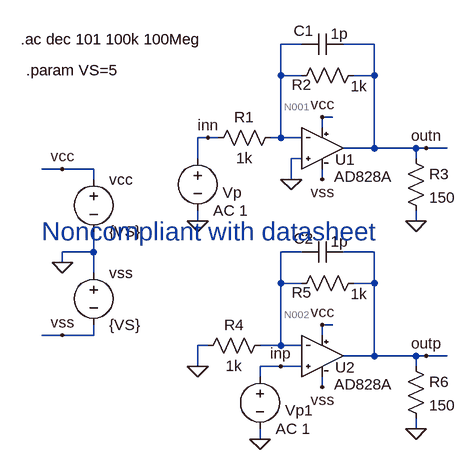
[diagram p0: schematic 03-ad828a_active_probe_ac.asc]
03-ad828a_active_probe_ac.asc, the LTspice schematic file:
Version 4
SHEET 1 880 680
WIRE 256 -240 224 -240
WIRE 368 -240 320 -240
WIRE 224 -192 224 -240
WIRE 256 -192 224 -192
WIRE 368 -192 368 -240
WIRE 368 -192 336 -192
WIRE 304 -128 288 -128
WIRE 288 -112 288 -128
WIRE 112 -96 96 -96
WIRE 128 -96 112 -96
WIRE 224 -96 224 -192
WIRE 224 -96 208 -96
WIRE 256 -96 224 -96
WIRE 368 -80 368 -192
WIRE 368 -80 320 -80
WIRE 432 -80 368 -80
WIRE 448 -80 432 -80
WIRE 480 -80 448 -80
WIRE 96 -64 96 -96
WIRE 256 -64 240 -64
WIRE 432 -64 432 -80
WIRE -112 -48 -144 -48
WIRE -64 -48 -112 -48
WIRE -64 -32 -64 -48
WIRE 240 -32 240 -64
WIRE 288 -32 288 -48
WIRE 96 32 96 16
WIRE 432 32 432 16
WIRE -64 80 -64 48
WIRE -64 80 -112 80
WIRE 256 80 224 80
WIRE 368 80 320 80
WIRE -112 96 -112 80
WIRE -64 112 -64 80
WIRE 224 128 224 80
WIRE 256 128 224 128
WIRE 368 128 368 80
WIRE 368 128 336 128
WIRE 304 192 288 192
WIRE -112 208 -144 208
WIRE -64 208 -64 192
WIRE -64 208 -112 208
WIRE 288 208 288 192
WIRE 112 224 96 224
WIRE 224 224 224 128
WIRE 224 224 192 224
WIRE 256 224 224 224
WIRE 368 240 368 128
WIRE 368 240 320 240
WIRE 432 240 368 240
WIRE 448 240 432 240
WIRE 480 240 448 240
WIRE 96 256 96 224
WIRE 224 256 192 256
WIRE 256 256 224 256
WIRE 432 256 432 240
WIRE 192 272 192 256
WIRE 288 288 288 272
WIRE 432 352 432 336
WIRE 192 368 192 352
FLAG -112 96 0
FLAG -112 208 vss
FLAG -112 -48 vcc
FLAG 288 -128 vcc
FLAG 288 -32 vss
FLAG 96 32 0
FLAG 240 -32 0
FLAG 432 32 0
FLAG 448 -80 outn
FLAG 112 -96 inn
FLAG 288 192 vcc
FLAG 288 288 vss
FLAG 192 368 0
FLAG 96 256 0
FLAG 432 352 0
FLAG 448 240 outp
FLAG 224 256 inp
SYMBOL AD828A 288 -80 R0
WINDOW 0 35 33 Bottom 2
WINDOW 3 63 28 Top 2
SYMATTR InstName U1
SYMBOL voltage -64 96 R0
SYMATTR InstName vss
SYMATTR Value {VS}
SYMBOL voltage -64 -48 R0
WINDOW 123 0 0 Left 0
WINDOW 39 0 0 Left 0
SYMATTR InstName vcc
SYMATTR Value {VS}
SYMBOL voltage 96 -80 R0
WINDOW 0 39 68 Left 2
SYMATTR InstName Vp
SYMATTR Value AC 1
SYMBOL res 224 -112 R90
WINDOW 0 0 56 VBottom 2
WINDOW 3 32 56 VTop 2
SYMATTR InstName R1
SYMATTR Value 1k
SYMBOL res 352 -208 R90
WINDOW 0 46 96 VBottom 2
WINDOW 3 17 8 VTop 2
SYMATTR InstName R2
SYMATTR Value 1k
SYMBOL cap 320 -256 R90
WINDOW 0 11 61 VBottom 2
WINDOW 3 -16 6 VTop 2
SYMATTR InstName C1
SYMATTR Value 1p
SYMBOL res 416 -80 R0
SYMATTR InstName R3
SYMATTR Value 150
SYMBOL AD828A 288 240 R0
WINDOW 0 35 33 Bottom 2
WINDOW 3 63 28 Top 2
SYMATTR InstName U2
SYMBOL voltage 192 256 R0
WINDOW 0 39 68 Left 2
SYMATTR InstName Vp1
SYMATTR Value AC 1
SYMBOL res 208 208 R90
WINDOW 0 0 56 VBottom 2
WINDOW 3 32 56 VTop 2
SYMATTR InstName R4
SYMATTR Value 1k
SYMBOL res 352 112 R90
WINDOW 0 46 96 VBottom 2
WINDOW 3 17 8 VTop 2
SYMATTR InstName R5
SYMATTR Value 1k
SYMBOL cap 320 64 R90
WINDOW 0 11 61 VBottom 2
WINDOW 3 -16 6 VTop 2
SYMATTR InstName C2
SYMATTR Value 1p
SYMBOL res 416 240 R0
SYMATTR InstName R6
SYMATTR Value 150
TEXT -176 -248 Left 2 !.ac dec 101 100k 100Meg
TEXT -168 -200 Left 2 !.param VS=5
TEXT -144 48 Left 4 ;Noncompliant with datasheet

The netlist it stands for:
* 03-ad828a_active_probe_ac.asc
XU1 0 N001 vcc vss outn AD828A  ; pins 2 1 99 50 46
vss 0 vss {VS}
vcc vcc 0 {VS}
Vp inn 0 AC 1
R1 N001 inn 1k
R2 outn N001 1k
C1 outn N001 1p
R3 outn 0 150
XU2 inp N002 vcc vss outp AD828A  ; pins 2 1 99 50 46
Vp1 inp 0 AC 1
R4 N002 0 1k
R5 outp N002 1k
C2 outp N002 1p
R6 outp 0 150
.ac dec 101 100k 100Meg
.param VS=5
* Noncompliant with datasheet
.lib ad828a.cir
.backanno
.end

* Results of the author's LTspice run, read from the files saved beside the schematic
* Operating Point, zero values left out:
*   V(vss) = -5 V
*   V(n001) = 1.998 mV
*   V(vcc) = 5 V
*   V(outn) = 10.45 mV
*   V(n002) = 1.998 mV
*   V(outp) = 10.45 mV
*   I(R1) = 1.998 µA
*   I(R2) = 8.448 µA
*   I(R3) = 69.64 µA
*   I(R4) = 1.998 µA
*   I(R5) = 8.448 µA
*   I(R6) = 69.64 µA
*   I(Vss) = -14.03 mA
*   I(Vcc) = -14.16 mA
*   I(Vp) = 1.998 µA
*   I(Vp1) = -6.75 µA
*   Ix(u1:2) = 6.75 µA
*   Ix(u1:1) = 6.45 µA
*   Ix(u1:99) = 7.078 mA
*   Ix(u1:50) = -7.013 mA
*   Ix(u1:46) = -78.09 µA
*   Ix(u2:2) = 6.75 µA
*   Ix(u2:1) = 6.45 µA
*   Ix(u2:99) = 7.078 mA
*   Ix(u2:50) = -7.013 mA
*   Ix(u2:46) = -78.09 µA
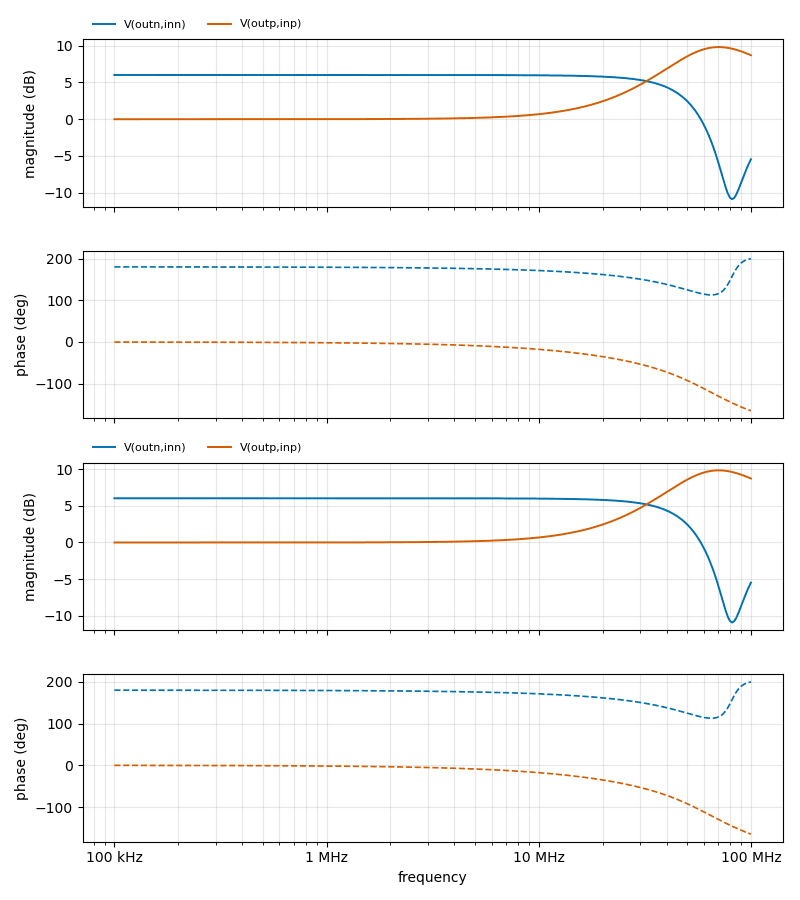
[diagram p1: AC Analysis of 03-ad828a_active_probe_ac.asc, plotted from the saved traces]
* AC Analysis, 1 run:
*   V(outn,inn): 6.02 dB at 100 kHz, -5.46 dB at 100 MHz, peak 6.02 dB at 100 kHz, 3 dB below the peak at 47.66 MHz
*   V(outp,inp): -0.01 dB at 100 kHz, 8.71 dB at 100 MHz, peak 9.82 dB at 71.04 MHz, 3 dB below the peak at 39.77 MHz
*   V(outn,inn): 6.02 dB at 100 kHz, -5.46 dB at 100 MHz, peak 6.02 dB at 100 kHz, 3 dB below the peak at 47.66 MHz
*   V(outp,inp): -0.01 dB at 100 kHz, 8.71 dB at 100 MHz, peak 9.82 dB at 71.04 MHz, 3 dB below the peak at 39.77 MHz